# Altium schematic sheet Power Management IC.SchDoc
size A3
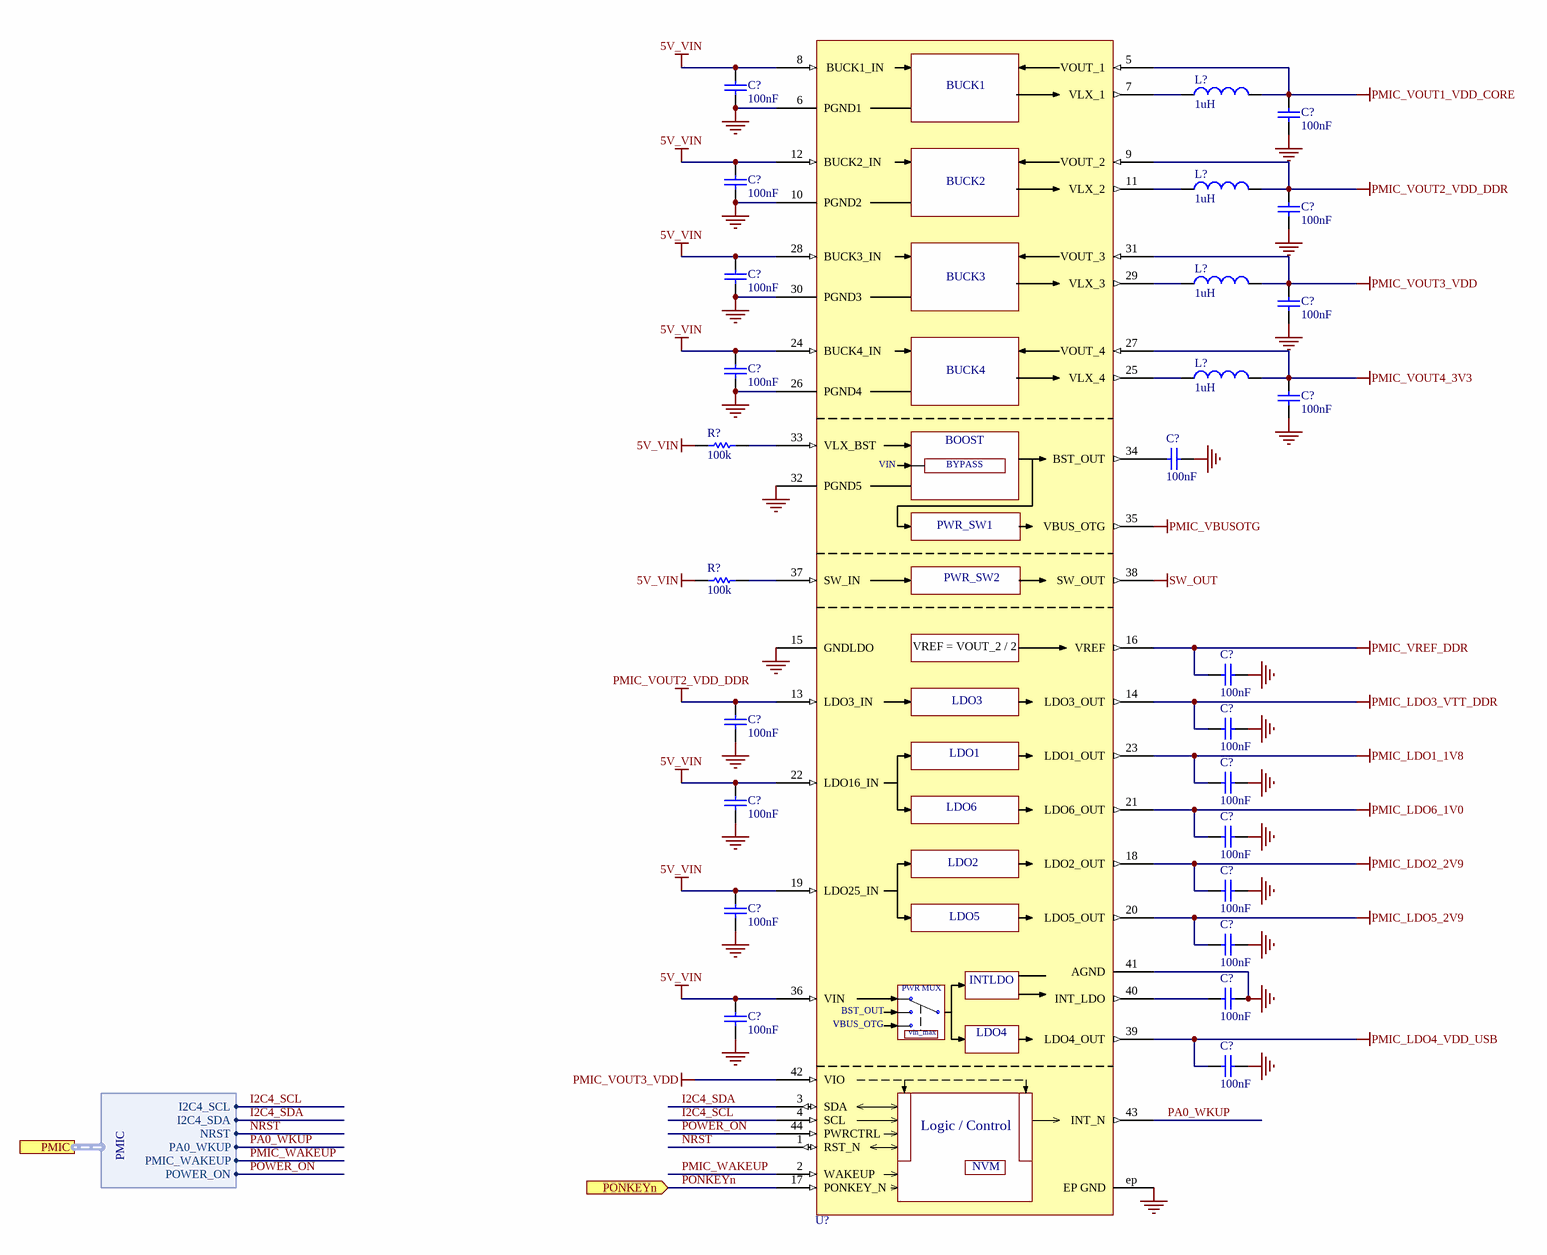
[diagram p0: Power Management IC.SchDoc]

## Parts
(Parts that share a designator on the sheet are numbered #1, #2 ... from top to bottom, then left to right.)
C?#1  100nF
C?#2  100nF
C?#3  100nF
C?#4  100nF
C?#5  100nF
C?#6  100nF
C?#7  100nF
C?#8  100nF
C?#9  100nF
C?#10  100nF
C?#11  100nF
C?#12  100nF
C?#13  100nF
C?#14  100nF
C?#15  100nF
C?#16  100nF
C?#17  100nF
C?#18  100nF
C?#19  100nF
C?#20  100nF
C?#21  100nF
L?#1  1uH
L?#2  1uH
L?#3  1uH
L?#4  1uH
R?#1  100k
R?#2  100k
U?  STPMIC1BPQR  (value not drawn)

## Ports
PMIC (harness PMIC), PONKEYn (in)

## Harnesses
PMIC: I2C4_SCL, I2C4_SDA, NRST, PA0_WKUP, PMIC_WAKEUP, POWER_ON

## Nets
5V_VIN: C?#1.1 C?#3.1 C?#5.1 C?#7.1 C?#14.1 C?#17.1 C?#20.1 R?#1.1 R?#2.1 U?.8(BUCK1_IN) U?.12(BUCK2_IN) U?.19(LDO25_IN) U?.22(LDO16_IN) U?.24(BUCK4_IN) U?.28(BUCK3_IN) U?.36(VIN)
GND: C?#1.2 C?#2.2 C?#3.2 C?#4.2 C?#5.2 C?#6.2 C?#7.2 C?#8.2 C?#9.1 C?#10.1 C?#11.2 C?#12.1 C?#13.1 C?#14.2 C?#15.1 C?#16.1 C?#17.2 C?#18.1 C?#19.1 C?#20.2 C?#21.1 U?.6(PGND1) U?.10(PGND2) U?.15(GNDLDO) U?.26(PGND4) U?.30(PGND3) U?.32(PGND5) U?.41(AGND) U?.ep(EP_GND)
PMIC_LDO1_1V8: C?#13.2 U?.23(LDO1_OUT)
PMIC_LDO2_2V9: C?#16.2 U?.18(LDO2_OUT)
PMIC_LDO3_VTT_DDR: C?#12.2 U?.14(LDO3_OUT)
PMIC_LDO4_VDD_USB: C?#21.2 U?.39(LDO4_OUT)
PMIC_LDO5_2V9: C?#18.2 U?.20(LDO5_OUT)
PMIC_LDO6_1V0: C?#15.2 U?.21(LDO6_OUT)
PMIC_VBUSOTG: U?.35(VBUS_OTG)
PMIC_VOUT1_VDD_CORE: C?#2.1 L?#1.2 U?.5(VOUT_1)
PMIC_VOUT2_VDD_DDR: C?#4.1 C?#11.1 L?#2.2 U?.9(VOUT_2) U?.13(LDO3_IN)
PMIC_VOUT3_VDD: C?#6.1 L?#3.2 U?.31(VOUT_3) U?.42(VIO)
PMIC_VOUT4_3V3: C?#8.1 L?#4.2 U?.27(VOUT_4)
PMIC_VREF_DDR: C?#10.2 U?.16(VREF)
SW_OUT: U?.38(SW_OUT)
I2C4_SCL: U?.4(SCL) ; port PMIC.I2C4_SCL
I2C4_SDA: U?.3(SDA) ; port PMIC.I2C4_SDA
NRST: U?.1(RST_N) ; port PMIC.NRST
PA0_WKUP: U?.43(INT_N) ; port PMIC.PA0_WKUP
PMIC_WAKEUP: U?.2(WAKEUP) ; port PMIC.PMIC_WAKEUP
PONKEYn: U?.17(PONKEY_N) ; port PONKEYn
POWER_ON: U?.44(PWRCTRL) ; port PMIC.POWER_ON
NetC?#9_2: C?#9.2 U?.34(BST_OUT)
NetC?#19_2: C?#19.2 U?.40(INT_LDO)
NetL?#1_1: L?#1.1 U?.7(VLX_1)
NetL?#2_1: L?#2.1 U?.11(VLX_2)
NetL?#3_1: L?#3.1 U?.29(VLX_3)
NetL?#4_1: L?#4.1 U?.25(VLX_4)
NetR?#1_2: R?#1.2 U?.33(VLX_BST)
NetR?#2_2: R?#2.2 U?.37(SW_IN)

## Notes on the sheet
- Title
- Size:
- Date:
- A3
- Revision:
- Project Name:
- Sheet:
- of
- Drawn By:
- Checked By:
- www.logicboards.org
- (in symbol STPMIC1BPQR) BUCK1; BUCK2; BUCK3; BUCK4; BOOST; BYPASS; PWR_SW1; PWR_SW2; VREF = VOUT_2 / 2; LDO3; LDO1; LDO6; LDO2; LDO5; INTLDO; PWR MUX; vin_max; LDO4; Logic / Control; NVM

## Library data of the parts
C?#1-C?#21 = CAP_SMD: Capacitor MLCC; Tolerance: 10%; Dielectric: X5R; Voltage Rating: 6.3V; Supplier 1: Mouser; Manufacturer 1: *; Manufacturer Part Number 1: *; RoHS: Yes; Mount: Surface Mount; Package: *; Capacitance: *; Length: *; Lead Free: Lead Free; Supplier Part Number 1: *; Supplier 2: Digikey; Supplier Part Number 2: *; Value: 100nF
L?#1-L?#4 = IND_SMD: Inductor SMD; Manufacturer Part Number 1: MGV2520101R5M-10; Supplier 1: Mouser; RoHS: Yes; Category: Fixed Inductors; RoHS Compliant: Yes; Supplier 2: Digi-Key; Supplier Part Number 1: 739-MGV2520101R5M-10; Supplier Part Number 2: 240-3070-1-ND; Value: 1uH
R?#1 R?#2 = RES_SMD: General Purpose Chip Resistor Thick Film; Supplier 1: Mouser; RoHS: Yes; Category: Resistors; RoHS Compliant: Yes; Resistance: *; Supplier 2: Digikey; Supplier Part Number 2: *; Package: *; Value: 100k
U? = STPMIC1BPQR: IC ST MPU Power Management IC; Manufacturer 1: STMicroelectronics; Supplier 1: Mouser; Manufacturer Part Number 1: STPMIC1BPQR; RoHS: Yes; Category: Power Management ICs; Supplier 2: Digi-Key; Datasheet: https://www.st.com/resource/en/datasheet/stpmic1.pdf; Supplier Part Number 1: 511-STPMIC1BPQR; Supplier Part Number 2: 497-STPMIC1BPQRDKR-ND